# Altium schematic sheet 6301 Lab3 Main.SchDoc: Main Sheet
size Letter; Author: M. Holachek; Revision: 1; SheetNumber: 1; SheetTotal: 3
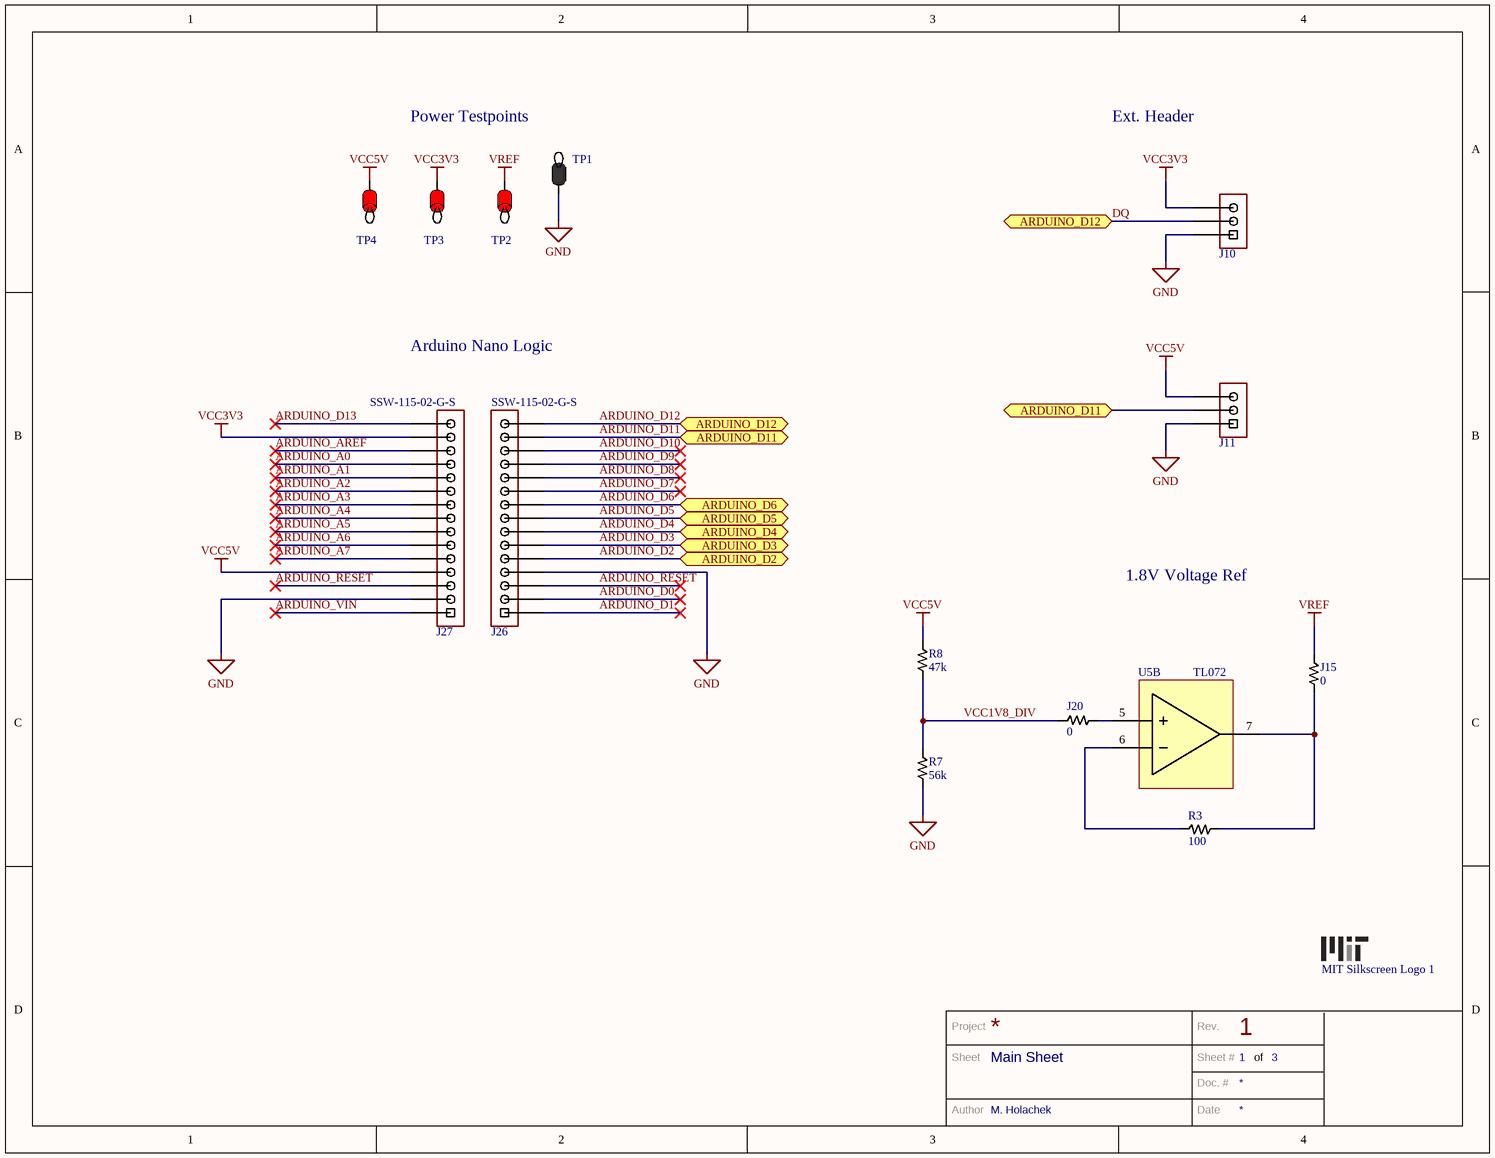
[diagram p0: 6301 Lab3 Main.SchDoc]

## Parts
J10  Short  [1X03]  (value not drawn)
J11  Short  [1X03]  (value not drawn)
J15  0  [JUMP0402]
J20  0  [JUMP0402]
J26  SSW-115-02-G-S  [1x15]
J27  SSW-115-02-G-S  [1x15]
MIT_Silkscreen_Logo_1  MIT Logo  [MITLOGO]  (value not drawn)  (no BOM)
R3  100  [RES0805]
R7  56k  [RES0805]
R8  47k  [RES0805]
TP1  Black  [TP_BLACK]  (value not drawn)
TP2  Red  [TP_RED]  (value not drawn)
TP3  Red  [TP_RED]  (value not drawn)
TP4  Red  [TP_RED]  (value not drawn)
U5  TL072  [SOIC8]  (part B of 2)

## Ports
ARDUINO_D2, ARDUINO_D3, ARDUINO_D4, ARDUINO_D5, ARDUINO_D6, ARDUINO_D11, ARDUINO_D12

## Nets
GND: J10.1 J11.1 J26.4 J27.2 R7.1 TP1.1
VCC3V3: J10.3 J27.14 TP3.1
VCC5V: J11.3 J27.4 R8.2 TP4.1
VREF: J15.2 TP2.1
ARDUINO_A0: J27.12
ARDUINO_A1: J27.11
ARDUINO_A2: J27.10
ARDUINO_A3: J27.9
ARDUINO_A4: J27.8
ARDUINO_A5: J27.7
ARDUINO_A6: J27.6
ARDUINO_A7: J27.5
ARDUINO_AREF: J27.13
ARDUINO_D0: J26.2
ARDUINO_D1: J26.1
ARDUINO_D2: J26.5 ; port ARDUINO_D2
ARDUINO_D3: J26.6 ; port ARDUINO_D3
ARDUINO_D4: J26.7 ; port ARDUINO_D4
ARDUINO_D5: J26.8 ; port ARDUINO_D5
ARDUINO_D6: J26.9 ; port ARDUINO_D6
ARDUINO_D7: J26.10
ARDUINO_D8: J26.11
ARDUINO_D9: J26.12
ARDUINO_D10: J26.13
ARDUINO_D11: J11.2 J26.14 ; port ARDUINO_D11
ARDUINO_D12: J10.2 J26.15 ; port ARDUINO_D12  [also labelled DQ]
ARDUINO_D13: J27.15
ARDUINO_RESET: J26.3 J27.3
ARDUINO_VIN: J27.1
VCC1V8_DIV: J20.1 R7.2 R8.1
NetJ15_1: J15.1 R3.1 U5.7(2OUT)
NetJ20_2: J20.2 U5.5(2IN+)
NetR3_2: R3.2 U5.6(2IN-)

## Notes on the sheet
- Power Testpoints
- Ext. Header
- Arduino Nano Logic
- 1.8V Voltage Ref
- Project
- Rev.
- Sheet
- Author
- Doc. #
- Sheet #
- Date
- of

## Library data of the parts
J10 J11 = 1x3: 1x3 2.54mm Standard Connector
J15 J20 = Jumper 0402: Jumper, 0402 Package
J26 J27 = 1x15: 1x15 2.54mm Standard Connector
R3 R8 = Resistor: Resistor, 0805 Package; Temp Co: +/- 25ppm; Tolerance: 1%
  R8: Digikey P/N: RG20P499KBCT-ND
R7 = Resistor: Resistor, 0805 Package; Temp Co: +/- 25ppm; Tolerance: 0.1%; Digikey P/N: RG20P499KBCT-ND
TP1 = Black Test Point
TP2-TP4 = Red Test Point
U5 = TL07xx: Dual Low-Noise JFET-Input Op Amp